# Altium project MEMESAT - PoBoI - Updated LTC.PrjPcb (part 2 of 2)

## Sheet PC104.SchDoc
size A; SheetNumber: 1; SheetTotal: 18
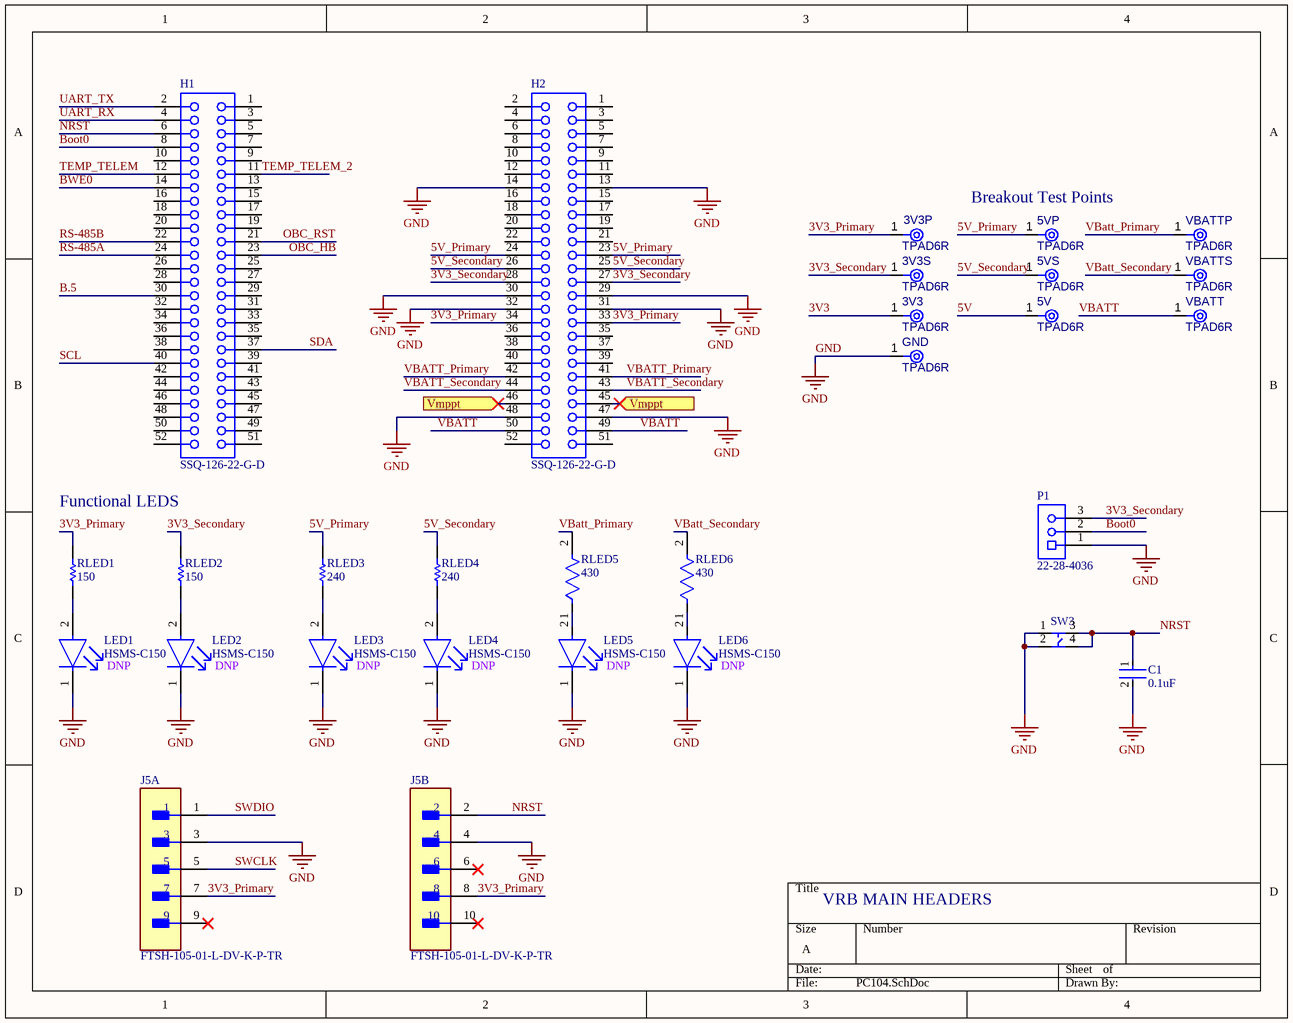
[diagram p7: PC104.SchDoc]

### Parts
3V3  TPAD6R  [TP06R]  (no BOM)
3V3P  TPAD6R  [TP06R]  (no BOM)
3V3S  TPAD6R  [TP06R]  (no BOM)
5V  TPAD6R  [TP06R]  (no BOM)
5VP  TPAD6R  [TP06R]  (no BOM)
5VS  TPAD6R  [TP06R]  (no BOM)
C1  0.1uF  [FP-C0603-CJ-MFG]
GND  TPAD6R  [TP06R]  (no BOM)
H1  SSQ-126-22-G-D  [SMTC-SSQ-126-22-X-D]
H2  SSQ-126-22-G-D  [SMTC-SSQ-126-22-X-D]
J5  FTSH-105-01-L-DV-K-P-TR  [FP-FTSH-105-01-L-DV-K-P-T-MFG]  (parts A,B of 2)
LED1  HSMS-C150  [FP-HSMS-C150-MFG]
LED2  HSMS-C150  [FP-HSMS-C150-MFG]
LED3  HSMS-C150  [FP-HSMS-C150-MFG]
LED4  HSMS-C150  [FP-HSMS-C150-MFG]
LED5  HSMS-C150  [FP-HSMS-C150-MFG]
LED6  HSMS-C150  [FP-HSMS-C150-MFG]
P1  22-28-4036  [22-28-4036-Footprint-1]
RLED1  150  [RESC1608X55X25ML10T15]
RLED2  150  [RESC1608X55X25ML10T15]
RLED3  240  [RESC1608X55X30NL20T20]
RLED4  240  [RESC1608X55X30NL20T20]
RLED5  430  [FP-CRCW0603-e3-IPC_B]
RLED6  430  [FP-CRCW0603-e3-IPC_B]
SW3  TS04-66-43-BK-100-SMT  [SOP127P600-8N]  (value not drawn)
VBATT  TPAD6R  [TP06R]  (no BOM)
VBATTP  TPAD6R  [TP06R]  (no BOM)
VBATTS  TPAD6R  [TP06R]  (no BOM)

### Ports
Vmppt (in)

### Nets
GND: C1.2 GND.1(TP) H2.13 H2.14 H2.29 H2.30 H2.31 H2.32 H2.47 H2.48 J5.3 J5.4 LED1.1(C) LED2.1(C) LED3.1(C) LED4.1(C) LED5.1(C) LED6.1(C) P1.1 SW3.1 SW3.2
3V3: 3V3.1(TP)
3V3_Primary: 3V3P.1(TP) H2.33 H2.34 J5.7 J5.8 RLED1.2
3V3_Secondary: 3V3S.1(TP) H2.27 H2.28 P1.3 RLED2.2
5V: 5V.1(TP)
5V_Primary: 5VP.1(TP) H2.23 H2.24 RLED3.2
5V_Secondary: 5VS.1(TP) H2.25 H2.26 RLED4.2
B.5: H1.30
Boot0: H1.8 P1.2
BWE0: H1.14
NRST: C1.1 H1.6 J5.2 SW3.3 SW3.4
OBC_HB: H1.23
OBC_RST: H1.21
RS-485A: H1.24
RS-485B: H1.22
SCL: H1.40
SDA: H1.37
SWCLK: J5.5
SWDIO: J5.1
TEMP_TELEM: H1.12
TEMP_TELEM_2: H1.11
UART_RX: H1.4
UART_TX: H1.2
VBATT: H2.49 H2.50 VBATT.1(TP)
VBatt_Primary: H2.41 H2.42 RLED5.2 VBATTP.1(TP)
VBatt_Secondary: H2.43 H2.44 RLED6.2 VBATTS.1(TP)
NetH2_45: H2.45 H2.46 ; port Vmppt
NetLED1_2: LED1.2(A) RLED1.1
NetLED2_2: LED2.2(A) RLED2.1
NetLED3_2: LED3.2(A) RLED3.1
NetLED4_2: LED4.2(A) RLED4.1
NetLED5_2: LED5.2(A) RLED5.1
NetLED6_2: LED6.2(A) RLED6.1

Not connected (* = marked no-connect by the designer): H1 1 3 5 7 9 10 13 15 16 17 18 19 20 25 26 27 28 29 31 32 33 34 35 36 38 39 41 42 43 44 45 46 47 48 49 50 51 52; H2 1 2 3 4 5 6 7 8 9 10 11 12 15 16 17 18 19 20 21 22 35 36 37 38 39 40 51 52; J5 6* 9* 10*

### Notes on the sheet
- (near 5VP) Breakout Test Points
- Functional LEDS
- (near LED1) DNP
- (near LED2) DNP
- (near LED3) DNP
- (near LED4) DNP
- (near LED5) DNP
- (near LED6) DNP
- VRB MAIN HEADERS

### Library data of the parts
3V3 3V3P 3V3S 5V 5VP 5VS GND VBATT VBATTP VBATTS = CMP-00028-00002-2: 0.6mm round; Pins: 1
C1 = CMP-2006-03300-2: CAP CER 0.1UF 50V X7R 0603 / C0603X104K5RACTU; Manufacturer: Kemet; Capacitance: 100nF; Material: Ceramic; Tolerance: 10%; Value: 100nF; Temperature Coefficient: 15%; Temperature Range High: +125°C; Temperature Range Low: -55°C; Manufacturer Part Number: C0603X104K5RACTU; Voltage: 50V; ComponentLink2Description: Datasheet; RoHS: TRUE; ComponentLink2URL: https://content.kemet.com/datasheets/KEM_C1013_X7R_FT-CAP_SMD.pdf; Device Class L3: Ceramic Capacitors; Device Class L2: Capacitors; Package: C0603-CJ; Height: 0.95mm; Device Class L1: Passive Components; Temperature Characteristic: X7R; Lead Free: Yes; Digikey Description: CAP CER 0.1UF 50V X7R 0603; Automotive: No; Mouser Description: Capacitor; Ceramic; Cap 0.1uF; Tol+10%; SMT; Flexible Termination; Vol-Rtg 50V; TR; Temperature: -55°C to +125°C; Octopart: https://octopart.com/c0603x104k5ractu-kemet-9145062; Category: Cap; Voltage Rating: 50V; Ipc Land Pattern Name: CAPC16080X80
H1 H2 = CMP-1023-00317-1: SQ Post Socket, Through-hole, Vertical, -55 to 125 degC, 2.54 mm Pitch, 52-Pin, Female, RoHS; Manufacturer: Samtec; Pitch: 2.54 mm; ComponentLink1Description: Manufacturer URL; ComponentLink3Description: Package Specification; PackageVersion: BD, 6/1987; ComponentLink2URL: http://www.samtec.com/documents/webfiles/pdf/SSQ_TH.PDF; Temperature Range: -55 to 125 degC; PackageDescription: Assembly, Socket Strip .025[0.64] SQ Tail; Mounting Technology: Through-hole; ComponentLink3URL: http://www.samtec.com/documents/webfiles/cpdf/SSQ-1XX-XX-XXX-X-XX-XXX-XX-X-MKT.pdf; PartNumber: SSQ-126-22-G-D; ComponentLink2Description: Datasheet; ComponentLink1URL: http://www.samtec.com; DatasheetVersion: F-214; RoHS: True; Orientation: Vertical; PackageReference: SSQ-126-22-X-D
J5 = CMP-002-00076-1: Board Connector, 10 Contact(s), 2 Row(s), Male, Straight, 0.05 inch Pitch, Surface Mount Terminal, Locking; RoHS Compliant: Yes; Connector Type: BOARD CONNECTOR; Mounting Technology: Board
LED1-LED6 = CMP-21615-000001-1: LED RED DIFFUSED CHIP SMD; Luminous Intensity: 10mcd; Power Dissipation: 65mW; Viewing Angle: 170°; Number of Elements: 1; Forward Current: 20mA; Lens Color: White; Lens Style: Rectangular; Wavelength: 626nm; Forward Voltage: 2.1V; Reverse Voltage: 5V; Number of Pins: 2; Color: Red; Lead Free: Lead Free; Width: 1.6mm; Length: 3.2mm; REACH SVHC: No SVHC; Height: 1.1mm; Depth: 1.6mm; Power Rating: 65mW; Package Quantity: 1; Illumination Color: Red; Radiation Hardening: No; Case Code (Imperial): 1206; Max Operating Temperature: 85°C; Test Current: 20mA; Case/Package: 1206; Lens Transparency: Diffused; Number of LEDs: 1; Packaging: Tape and Reel; Mount: Surface Mount; Min Operating Temperature: -40°C; Case Code (Metric): 3216; Dominant Wavelength: 626nm
P1 = CMP-002-00073-2: KK 254 Breakaway Header, Vertical, 3 Circuits, 0.76µm Gold (Au) Selective Plating, Mating Pin Length 6.09mm; Voltage Rating: 250V; Gender: Male; Min Operating Temperature: 0°C; Mounting Technology: Through Hole; Pins: 3; Max Operating Temperature: 75°C
RLED1 RLED2 = CMP-1659-00057-1: Chip Resistor, 150 Ohm, +/- 1%, 0.1 W, -55 to 155 degC, 0603 (1608 Metric), RoHS, Tape and Reel / RC0603FR-07150RL; Viewing Angle: 20 degrees; Luminous Intensity: 200 mcd; Case\Package: Radial; Lens Style: Clear; Nominal Vf: 2.2 V; Illumination Colour: Green; PackageReference: 0603; PackageDescription: 2-Pin Surface Mount Device, Body 1.6 x 0.8 mm; Package Quantity: 1000; Packaging: Bulk; DatasheetVersion: Rev. 4, 02/2016; ComponentLink2URL: http://www.yageo.com/documents/recent/PYu-RC_Group_51_RoHS_L_04.pdf; ComponentLink1Description: Manufacturer URL; Height: 8.6 mm; ComponentLink2Description: Datasheet; Mount: Through Hole; Colour: Green; RoHSCompliant: true; ComponentLink1URL: http://www.yageo.com/; Forward Voltage: 2.2 V
RLED3 RLED4 = CMP-2000-00001-1: 240 Ohm 0603 / ERA3AEB244V; Manufacturer: Panasonic; Part Number: ERA3AEB244V
RLED5 RLED6 = CMP-1012-00468-3: RES Thick Film, 430Ω, 1%, 0.1W, 100ppm/°C, 0603 / CRCW0603430RFKEA; Power Rating: 100mW; Voltage Rating: 75V; Resistance: 430R; Radiation Hardening: No; Width: 0.033inch; Max Operating Temperature: 155°C; Height: 0.45mm; Temperature Coefficient: 100ppm/°C; Number of Terminations: 2; Package Quantity: 10; Composition: Thick Film; Mount: Surface Mount; Contact Plating: Tin; Tolerance: 1%; Voltage Rating (DC): 75V; Case/Package: 0603; Features: Automotive AEC-Q200; Case Code (Imperial): 0603; Depth: 0.85mm; Termination: SMD/SMT; Packaging: Tape and Reel; Min Operating Temperature: -55°C; Weight: 7.1E-05oz; Case Code (Metric): 1608; Number of Pins: 2; Military Standard: Not; Lead Free: Lead Free; Length: 1.55mm; Working Voltage: 75V; Max Power Dissipation: 100mW
SW3 = CMP-011-00014-3: Momentary Switch; Rated Voltage Max: 1 V; Rated Voltage Min: 12 V; Rated Current Max: 0.01 mA; Rated Current Min: 50 mA; DataSheet: https://www.cuidevices.com/product/resource/ts04.pdf

## Sheet STM32.SchDoc
size A; SheetNumber: 2; SheetTotal: 18
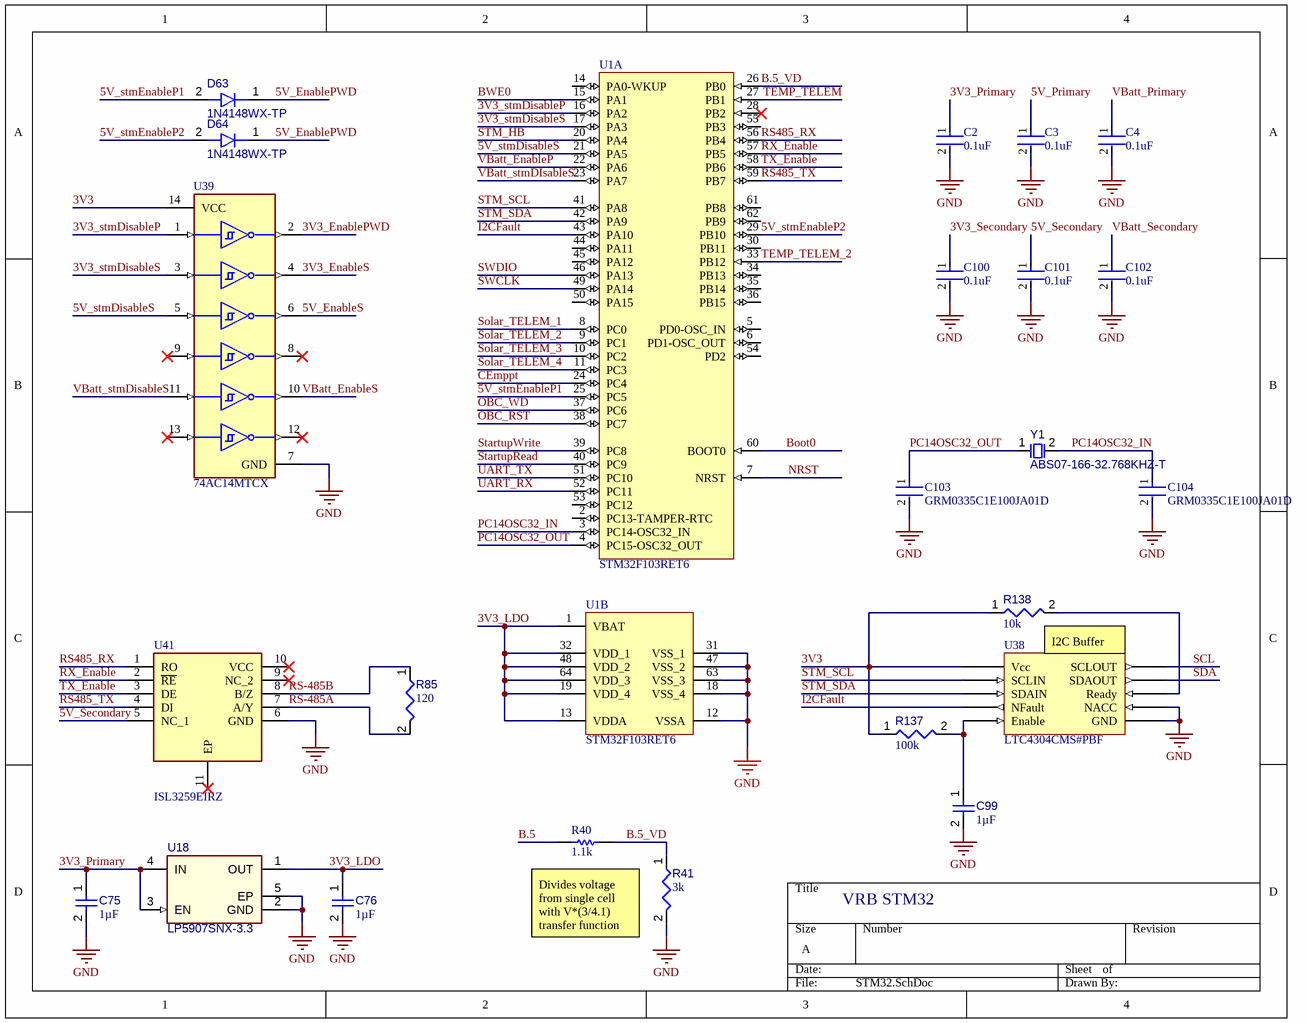
[diagram p8: STM32.SchDoc]

### Parts
C2  0.1uF  [FP-C0603-CJ-MFG]
C3  0.1uF  [FP-C0603-CJ-MFG]
C4  0.1uF  [FP-C0603-CJ-MFG]
C75  value 1µF  [FP-CC0201-BA-IPC_A]  (hidden comment: CC0201KRX5R5BB105)
C76  value 1µF  [FP-CC0201-BA-IPC_A]  (hidden comment: CC0201KRX5R5BB105)
C99  value 1µF  [CAPC1608X94X35NL15T15]  (hidden comment: Capacitor 1 uF +/- 10% 16 V 0603)
C100  0.1uF  [FP-C0603-CJ-MFG]
C101  0.1uF  [FP-C0603-CJ-MFG]
C102  0.1uF  [FP-C0603-CJ-MFG]
C103  GRM0335C1E100JA01D  [FP-GRM033-0_03-IPC_A]
C104  GRM0335C1E100JA01D  [FP-GRM033-0_03-IPC_A]
D63  1N4148WX-TP  [1N4148WX-TP-Footprint-1]
D64  1N4148WX-TP  [1N4148WX-TP-Footprint-1]
R40  1.1k  [RESC1005X40X25NL05T10]
R41  value 3k  [RESC0402(1005)_L]  (hidden comment: 3KR2F)
R85  value 120  [RESC0603(1608)_L]  (hidden comment: 120R3J)
R137  value 100k  [RESC3216X60X45ML15T20]  (hidden comment: Resistor 100k +/-1% 1206 250 mW)
R138  value 10k  [RESC1608X55X25ML10T15]  (hidden comment: Resistor 10k +/-1% 0603 100 mW)
U1  STM32F103RET6  [STM-LQFP64_N]  (parts A,B of 2)
U18  LP5907SNX-3.3  [TI-DQN4-480X480TP_V]
U38  LTC4304CMS#PBF  [LTC4304CMS#PBF-Footprint-1]
U39  74AC14MTCX  [FP-948G-MFG]
U41  ISL3259EIRZ  [ISL3259EIRZ-Footprint-1]
Y1  ABS07-166-32.768KHZ-T  [EPSON-FC-135_V]

### Nets
GND: C2.2 C3.2 C4.2 C75.2 C76.2 C99.2 C100.2 C101.2 C102.2 C103.2 C104.2 R41.2 U1.12(VSSA) U1.18(VSS_4) U1.31(VSS_1) U1.47(VSS_2) U1.63(VSS_3) U18.2(GND) U18.5(EP) U38.4(NACC) U38.5(GND) U39.7(GND) U41.6(GND)
3V3: R137.1 R138.1 U38.10(Vcc) U39.14(VCC)
3V3_EnablePWD: U39.2(~{O}0)
3V3_EnableS: U39.4(~{O}1)
3V3_LDO: C76.1 U1.1(VBAT) U1.13(VDDA) U1.19(VDD_4) U1.32(VDD_1) U1.48(VDD_2) U1.64(VDD_3) U18.1(OUT)
3V3_Primary: C2.1 C75.1 U18.3(EN) U18.4(IN)
3V3_Secondary: C100.1
3V3_stmDisableP: U1.16(PA2) U39.1(I0)
3V3_stmDisableS: U1.17(PA3) U39.3(I1)
5V_EnablePWD: D63.1(K) D64.1(K)
5V_EnableS: U39.6(~{O}2)
5V_Primary: C3.1
5V_Secondary: C101.1 U41.5(NC_1)
5V_stmDisableS: U1.21(PA5) U39.5(I2)
5V_stmEnableP1: D63.2(A) U1.25(PC5)
5V_stmEnableP2: D64.2(A) U1.29(PB10)
B.5: R40.1
B.5_VD: R40.2 R41.1 U1.26(PB0)
Boot0: U1.60(BOOT0)
BWE0: U1.15(PA1)
~{CEmppt}: U1.24(PC4)
I2CFault: U1.43(PA10) U38.7(NFault)
NRST: U1.7(NRST)
OBC_RST: U1.38(PC7)
OBC_WD: U1.37(PC6)
PC14OSC32_IN: C104.1 U1.3(PC14-OSC32_IN) Y1.2
PC14OSC32_OUT: C103.1 U1.4(PC15-OSC32_OUT) Y1.1
~{RX_Enable}: U1.57(PB5) U41.2(~{RE})
RS485_RX: U1.56(PB4) U41.1(RO)
RS485_TX: U1.59(PB7) U41.4(DI)
RS-485A: R85.2 U41.7(A/Y)
RS-485B: R85.1 U41.8(B/Z)
SCL: U38.2(SCLOUT)
SDA: U38.9(SDAOUT)
Solar_TELEM_1: U1.8(PC0)
Solar_TELEM_2: U1.9(PC1)
Solar_TELEM_3: U1.10(PC2)
Solar_TELEM_4: U1.11(PC3)
StartupRead: U1.40(PC9)
StartupWrite: U1.39(PC8)
STM_HB: U1.20(PA4)
STM_SCL: U1.41(PA8) U38.3(SCLIN)
STM_SDA: U1.42(PA9) U38.8(SDAIN)
SWCLK: U1.49(PA14)
SWDIO: U1.46(PA13)
TEMP_TELEM: U1.27(PB1)
TEMP_TELEM_2: U1.33(PB12)
TX_Enable: U1.58(PB6) U41.3(DE)
UART_RX: U1.52(PC11)
UART_TX: U1.51(PC10)
VBatt_EnableP: U1.22(PA6)
VBatt_EnableS: U39.10(~{O}4)
VBatt_Primary: C4.1
VBatt_Secondary: C102.1
VBatt_stmDIsableS: U1.23(PA7) U39.11(I4)
NetC99_1: C99.1 R137.2 U38.1(Enable)
NetR138_2: R138.2 U38.6(Ready)

Not connected (* = marked no-connect by the designer): U1 2(PC13-TAMPER-RTC) 5(PD0-OSC_IN) 6(PD1-OSC_OUT) 14(PA0-WKUP) 28(PB2)* 30(PB11) 34(PB13) 35(PB14) 36(PB15) 44(PA11) 45(PA12) 50(PA15) 53(PC12) 54(PD2) 55(PB3) 61(PB8) 62(PB9); U39 8(~{O}3)* 9(I3)* 12(~{O}5)* 13(I5)*; U41 9(NC_2)* 10(VCC)* 11(EP)*

### Notes on the sheet
- I2C Buffer
- VRB STM32
- Divides voltage from single cell with V*(3/4.1) transfer function

### Library data of the parts
C2-C4 C100-C102 = CMP-2006-03300-2: as C1 on sheet PC104; Temperature Range High: +125°C; Temperature Range Low: -55°C; Manufacturer Part Number: C0603X104K5RACTU; Voltage: 50V; ComponentLink2Description: Datasheet; RoHS: TRUE; ComponentLink2URL: https://content.kemet.com/datasheets/KEM_C1013_X7R_FT-CAP_SMD.pdf; Device Class L3: Ceramic Capacitors; Device Class L2: Capacitors; Package: C0603-CJ; Height: 0.95mm; Device Class L1: Passive Components; Temperature Characteristic: X7R; Lead Free: Yes; Digikey Description: CAP CER 0.1UF 50V X7R 0603; Automotive: No; Mouser Description: Capacitor; Ceramic; Cap 0.1uF; Tol+10%; SMT; Flexible Termination; Vol-Rtg 50V; TR; Temperature: -55°C to +125°C; Octopart: https://octopart.com/c0603x104k5ractu-kemet-9145062; Category: Cap; Voltage Rating: 50V; Ipc Land Pattern Name: CAPC16080X80
C75 C76 = CMP-001-00088-1: Ceramic Capacitor, Multilayer, Ceramic, 6.3V, 10% +Tol, 10% -Tol, X5R, 15% TC, 1uF, Surface Mount, 0201; Capacitor Type: Ceramic; Max Operating Temperature: 85°C; RoHS Compliant: Yes; Mounting Technology: Surface Mount; Min Operating Temperature: -55°C; Case/Package: 0201; Pins: 2
C99 = CMP-001-00003-6: Chip Capacitor, 1 uF, +/- 10%, 16 V, 0603 (1608 Metric); Voltage Rating: 16V; Capacitor Type: Ceramic; Max Operating Temperature: 125°C; Pins: 2; Tolerance: 10%; Min Operating Temperature: -55°C; RoHS Compliant: True; Mounting Technology: SM; Case/Package: 0603
C103 C104 = CMP-2010-01302-2: Chip Multilayer Ceramic Capacitors for General Purpose, 0201, 10pF, C0G, 30ppm/°C, 5%, 25V; Length: 0.024inch; Voltage Rating: 25V; Packaging: Tape and Reel; Max Operating Temperature: 125°C; Mount: Surface Mount; Capacitance: 10pF; Tolerance: 5%; Series: GRM; Case Code (Metric): 0603; Package Quantity: 1; Voltage Rating (DC): 25V; Depth: 0.3mm; Min Operating Temperature: -55°C; Width: 0.012inch; Thickness: 0.013inch; Termination: SMD/SMT; Lead Free: Lead Free; Case/Package: 0201; Case Code (Imperial): 0201; Dielectric: C0G; REACH SVHC: No SVHC
D63 = CMP-004-00035-2: Rectifier Diode, 1 Phase, 1 Element, 0.15A, 100V V(RRM), Silicon
D64 = CMP-004-00035-3: Rectifier Diode, 1 Phase, 1 Element, 0.15A, 100V V(RRM), Silicon
R40 = CMP-2002-07452-1: Part Number: RC0402FR-071K1L; Manufacturer: Yageo / Phycomp
R41 = CMP-009-00099-2: 3K 0.063W 1% 0402 (1005 Metric)  SMD; Power: 63mW; Case/Package: 0402; Tolerance: 1%; Mounting Technology: SMT; Pins: 2
R85 = CMP-009-00069-2: 120R 0.1W 5% 0603 (1608 Metric)  SMD; Power: 100mW; Mounting Technology: SMT; Tolerance: 5%; Case/Package: 0603; Pins: 2
R137 = CMP-009-00025-5: Chip Resistor, 100 KOhm, +/- 1%, 0.25 W, -55 to 155 degC, 1206 (3216 Metric); Voltage Rating: 200V; Power: 250mW; RoHS Compliant: True; Max Operating Temperature: 155°C; Pins: 2; Tolerance: 1%; Mounting Technology: SM; Case/Package: 1206; Min Operating Temperature: -55°C
R138 = CMP-009-00017-5: Chip Resistor, 10 KOhm, +/- 1%, 01 W, -55 to 155 degC, 0603 (1608 Metric); Voltage Rating: 50V; Power: 100mW; RoHS Compliant: True; Min Operating Temperature: -55°C; Pins: 2; Case/Package: 0603; Mounting Technology: SM; Max Operating Temperature: 155°C; Tolerance: 1%
U1 = CMP-0237-00201-3: ARM Cortex-M3 32-bit MCU, 512 KB Flash, 64 KB Internal RAM, 51 I/Os, 64-pin LQFP, -40 to 85 degC, Tray; FLASH Size (Prog) (kB): 512; Internal RAM Size (kB): 64; A/D Converter: 3x12-bit (16 Channel); I/Os (High Current): 51; Supply Voltage(Vcc) min (V): 2; D/A Converter: 2x12-bit (2 Channel); Operating Frequency(F) (Processor speed) (MHz): 72; PackageDescription: 64-Pin Low Profile Quad Flat Package, 10 x 10 mm Body, 0.5 mm Pitch; ComponentLink3URL: http://www.st.com/st-web-ui/static/active/en/resource/technical/document/datasheet/DM00037051.pdf; DatasheetVersion: Rev. 8; Packing: Tray; PackageReference: LQFP64; ComponentLink3Description: Package Specification; Core: ARM Cortex-M3; Mounting Technology: Surface Mount; PartNumber: STM32F103RET6; PackageVersion: Rev. 4, 06/2013; ComponentLink1URL: http://www.st.com/web/en/home.html; ComponentLink1Description: Manufacturer URL; ComponentLink2Description: Datasheet; ComponentLink2URL: http://www.st.com/st-web-ui/static/active/en/resource/technical/document/datasheet/CD00191185.pdf
U18 = CMP-019-00040-3: Ultra-Low-Noise, Low-IQ LDO, 3.3 V, 0.25 A, -40 to 125 degC, 4-Pin X2SON, RoHS, Tape and Reel; Output Voltage: 3.3V; Pins: 5; Max Operating Temperature: 125°C; Min Operating Temperature: -40°C
U38 = CMP-015-00009-7: Interface Circuit, PDSO10; Max Supply Voltage: 5.5V; Min Supply Voltage: 2.7V; Nominal Supply Voltage: 3.3V; RoHS Compliant: Yes; Max Operating Temperature: 70°C; Min Operating Temperature: 0°C; Pins: 10; Case/Package: TSSOP
U39 = CMP-016-00013-1: Inverter, AC Series, 6-Func, 1-Input, CMOS, PDSO14; Min Supply Voltage: 2V; Nominal Supply Voltage: 3.3V; Max Supply Voltage: 6V; RoHS Compliant: Yes; Case/Package: TSSOP; Min Operating Temperature: -40°C; Max Operating Temperature: 85°C; Pins: 14; Logic Type: INVERTER
U41 = CMP-015-00010-2: Line Transceiver, 1 Func, 1 Driver, 1 Rcvr, BICMOS, PDSO10; Min Supply Voltage: 4.75V; Nominal Supply Voltage: 5V; Max Supply Voltage: 5.25V; Case/Package: HVSON; RoHS Compliant: Yes; Pins: 10; Max Operating Temperature: 85°C; Min Operating Temperature: -40°C
Y1 = CMP-003-00029-1: Crystal 32.768kHz 10ppm 7pF -40C +85C; Pins: 2; Frequency: 32.768kHz

## Sheet VBATTPrimary.SchDoc
size A; SheetNumber: 15; SheetTotal: 18
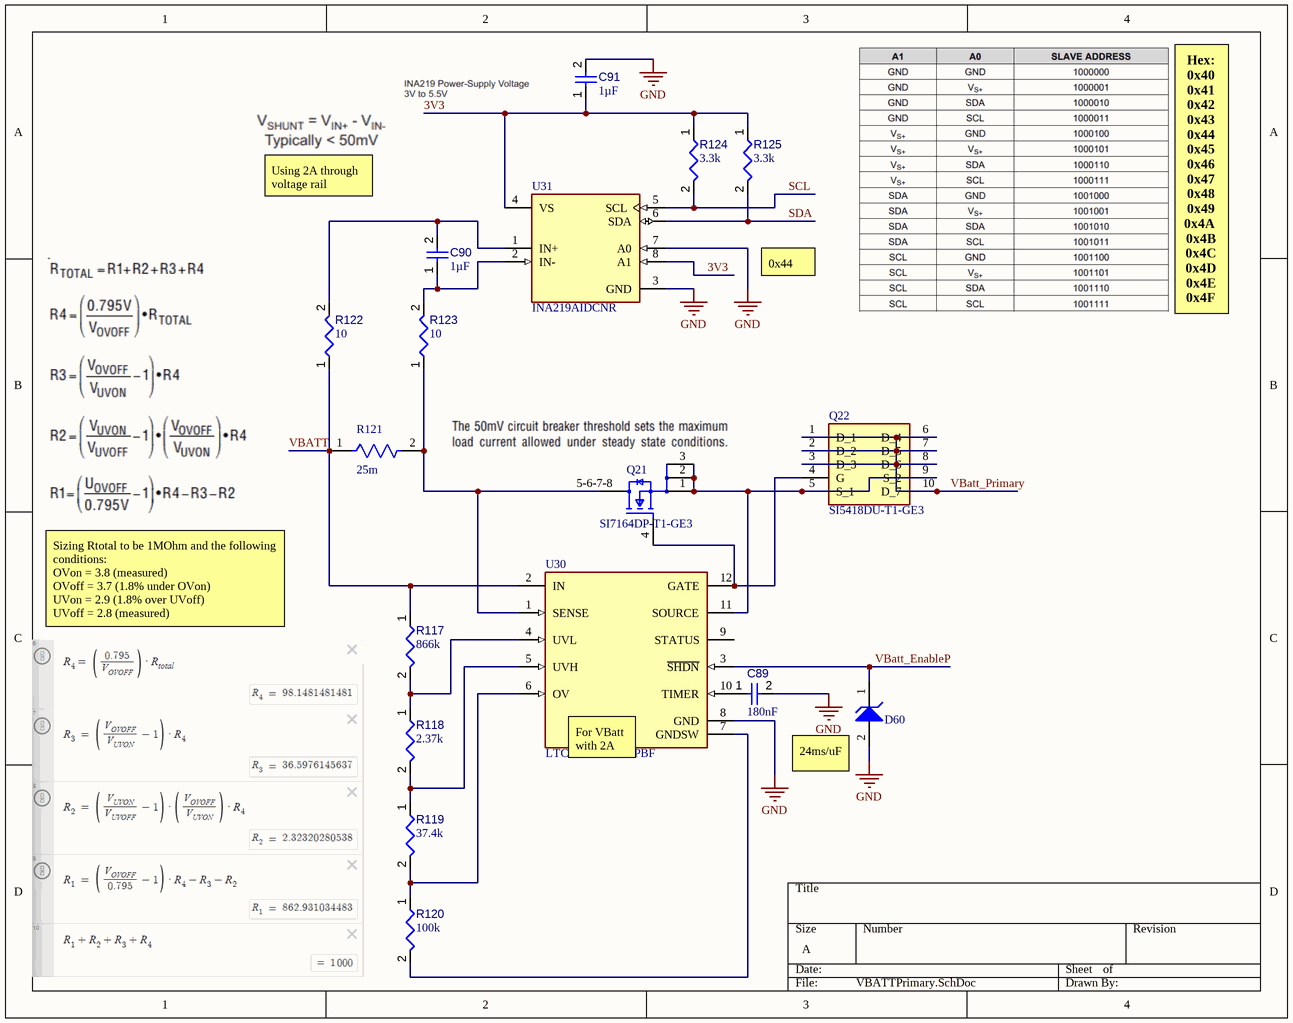
[diagram p9: VBATTPrimary.SchDoc]

### Parts
C89  value 180nF  [FP-C0805C-DN-IPC_A]  (hidden comment: C0805C184K5RACTU)
C90  value 1µF  [CAPC1608X90X40LL10T20]  (hidden comment: Capacitor 1 uF +/- 10% 25 V 0603)
C91  value 1µF  [CAPC1608X90X35ML15T15]  (hidden comment: Capacitor 1uF +/- 10% 16V 0603)
D60  MM3Z3V6T1G  [ONSC-SOD-323-2-477-02_V]  (value not drawn)
Q21  SI7164DP-T1-GE3  [Vishay_S17-0173-SINGLE_MFG]
Q22  SI5418DU-T1-GE3  [SI5418DU-T1-GE3-Footprint-1]
R117  value 866k  [RESC0603X26X15NL03T05]  (hidden comment: MC0201L6F8663SE)
R118  value 2.37k  [RESC0402(1005)_L]  (hidden comment: 2D37KR2F)
R119  value 37.4k  [FP-CR0603-IPC_A]  (hidden comment: CR0603-FX-3742ELF)
R120  value 100k  [RESC1005X40X25ML05T05]  (hidden comment: Resistor 100k +/-1% 0402 100 mW)
R121  Resistance: 25m  [FP-CSR1206-IPC_C]  (hidden comment: CSR1206FK25L0)
R122  value 10  [RESC0402(1005)_L]  (hidden comment: Resistor 10R  +/-1 % 0402 63 mW)
R123  value 10  [RESC0402(1005)_L]  (hidden comment: Resistor 10R  +/-1 % 0402 63 mW)
R124  value 3.3k  [FP-CRCW1210-e3-IPC_C]  (hidden comment: CRCW12103K30JNEA)
R125  value 3.3k  [FP-CRCW1210-e3-IPC_C]  (hidden comment: CRCW12103K30JNEA)
U30  LTC4231HMS-1#PBF  [FP-MS-12-05-08-1668-MFG]
U31  INA219AIDCNR  [FP-DCN0008A-IPC_A]

### Nets
GND: C89.2 C91.2 D60.2(A) U30.8(GND) U31.3(GND) U31.7(A0)
3V3: C91.1 R124.1 R125.1 U31.4(VS) U31.8(A1)
SCL: R124.2 U31.5(SCL)
SDA: R125.2 U31.6(SDA)
VBATT: R117.1 R121.1 R122.1 U30.2(IN)
VBatt_EnableP: D60.1(K) U30.3(~{SHDN})
VBatt_Primary: Q22.1(D_1) Q22.2(D_2) Q22.3(D_3) Q22.6(D_4) Q22.7(D_5) Q22.8(D_6) Q22.10(D_7)
NetC89_1: C89.1 U30.10(TIMER)
NetC90_1: C90.1 R123.2 U31.2(IN-)
NetC90_2: C90.2 R122.2 U31.1(IN+)
NetQ21_1: Q21.1(S) Q21.2(S) Q21.3(S) Q22.5(S_1) Q22.9(S_2) U30.11(SOURCE)
NetQ21_4: Q21.4(G) Q22.4(G) U30.12(GATE)
NetQ21_5-6-7-8: Q21.5-6-7-8(D) R121.2 R123.1 U30.1(SENSE)
NetR117_2: R117.2 R118.1 U30.4(UVL)
NetR118_2: R118.2 R119.1 U30.5(UVH)
NetR119_2: R119.2 R120.1 U30.6(OV)
NetR120_2: R120.2 U30.7(GNDSW)

Not connected (* = marked no-connect by the designer): U30 9(STATUS)

### Notes on the sheet
- Using 2A through voltage rail
- 0x44
- Hex:
  0x40
  0x41
  0x42
  0x43
  0x44
  0x45
  0x46
  0x47
  0x48
  0x49
  0x4A
  0x4B
  0x4C
  0x4D
  0x4E
  0x4F
- Sizing Rtotal to be 1MOhm and the following conditions:
  OVon = 3.8 (measured)
  OVoff = 3.7 (1.8% under OVon)
  UVon = 2.9 (1.8% over UVoff)
  UVoff = 2.8 (measured)
- (near U30) For VBatt
  with 2A
- (near D60) 24ms/uF

### Library data of the parts
C89 = CMP-001-00086-1: Ceramic Capacitor, Multilayer, Ceramic, 50V, 10% +Tol, 10% -Tol, X7R, 15% TC, 0.18uF, Surface Mount, 0805; Capacitor Type: Ceramic; Mounting Technology: Surface Mount; Pins: 2; Min Operating Temperature: -55°C; Case/Package: 0805; Max Operating Temperature: 125°C; RoHS Compliant: Yes
C90 = CMP-001-00005-6: Chip Capacitor, 1 uF, +/- 10%, 25 V, 0603 (1608 Metric); Capacitor Type: Ceramic; Voltage Rating: 25V; Pins: 2; Mounting Technology: SM; RoHS Compliant: True; Max Operating Temperature: 125°C; Case/Package: 0603; Min Operating Temperature: -55°C; Tolerance: 10%
C91 = CMP-001-00004-6: Chip Capacitor, 1 uF, +/- 10%, 16 V, 0603 (1608 Metric); Capacitor Type: Ceramic; Mounting Technology: SM; RoHS Compliant: True; Min Operating Temperature: -55°C; Case/Package: 0603; Pins: 2; Voltage Rating: 16V; Max Operating Temperature: 125°C; Tolerance: 10%
D60 = CMP-1060-00650-1: Zener Voltage Regulator, 300 mW, 2-Pin SOD-323, Pb-Free, Tape and Reel; Manufacturer: On Semiconductor; VZ Typ (V): 3.6; P Max (W): 0.3; RoHS: Pb-Free; ComponentLink1URL: http://www.onsemi.com/; PackageVersion: Rev. H, 03/2007; PartNumber: MM3Z3V6T1G; ComponentLink2Description: Datasheet; ComponentLink2URL: http://www.onsemi.cn/pub_link/Collateral/MM3Z2V4T1-D.PDF; DatasheetVersion: Rev. 9; PackageReference: SOD-323-2-477-02; ComponentLink3URL: http://www.onsemi.com/pub_link/Collateral/477-02.PDF.1; Packing: Tape and Reel; Mounting Technology: Surface Mount; ComponentLink3Description: Package Specification; PackageDescription: 2-Pin SOD, Body 1.7 x 1.25 mm; ComponentLink1Description: Manufacturer URL
Q21 = CMP-013-00040-1: Power Field-Effect Transistor, 23.5A I(D), 60V, 0.00625ohm, 1-Element, N-Channel, Silicon, Metal-oxide Semiconductor FET; Pins: 5; RoHS Compliant: Yes; Max Operating Temperature: 150°C
Q22 = CMP-013-00041-1: Power Field-Effect Transistor, 11.6A I(D), 30V, 0.0145ohm, 1-Element, N-Channel, Silicon, Metal-oxide Semiconductor FET; Max Operating Temperature: 150°C; RoHS Compliant: Yes; Pins: 3
R117 = CMP-009-00205-1: Fixed Resistor, Metal Glaze/thick Film, 0.05W, 866000ohm, 25V, 1% +/-Tol, -200,200ppm/Cel, 0201; Power: 50mW; Max Operating Temperature: 125°C; Tolerance: 1%; Case/Package: 0201; Pins: 2; RoHS Compliant: Yes; Min Operating Temperature: -55°C
R118 = CMP-009-00089-2: 2K37 0.063W 1% 0402 (1005 Metric)  SMD; Power: 63mW; Pins: 2; Tolerance: 1%; Case/Package: 0402; Mounting Technology: SMT
R119 = CMP-009-00206-1: Fixed Resistor, Metal Glaze/thick Film, 0.1W, 37400ohm, 75V, 1% +/-Tol, 100ppm/Cel, Surface Mount, 0603; Power: 100mW; Min Operating Temperature: -55°C; Mounting Technology: Surface Mount; Case/Package: 0603; Max Operating Temperature: 155°C; RoHS Compliant: Yes; Pins: 2; Tolerance: 1%
R120 = CMP-009-00022-5: Chip Resistor, 100 KOhm, +/- 1%, 0.1 W, -55 to 155 degC, 0402 (1005 Metric); Power: 100mW; Voltage Rating: 50V; Mounting Technology: SM; Pins: 2; Min Operating Temperature: -55°C; Tolerance: 1%; RoHS Compliant: True; Case/Package: 0402; Max Operating Temperature: 155°C
R121 = CMP-26527-000133-1: General Purpose Thick Film Chip Resistor, 1206, 25mΩ, 1%, 0.5W; Max Power Dissipation: 500mW; Temperature Coefficient: 100ppm/°C; Lead Free: Lead Free; Military Standard: Not; Case Code (Imperial): 1206; Max Operating Temperature: 155°C; Case Code (Metric): 3216; Height: 0.026inch; Packaging: Tape and Reel; Case/Package: 1206; Series: CSR; Number of Terminations: 2; RoHS Compliant: Yes; Mount: Surface Mount; Depth: 1.55mm; Contact Plating: Tin; Length: 0.12inch; Radiation Hardening: No; Width: 0.061inch; Size Code: 1206; Power Rating: 500mW; Min Operating Temperature: -55°C; Tolerance: 1%; Resistor Type: Thick Film; Construction: Rectangular
R122 R123 = CMP-009-00152-3: Chip Resistor, 10 Ohms, +/-1 %, 63 mW, -55 to 155 degC, 0402; Tolerance: 1%; Power: 63mW; Pins: 2; Max Operating Temperature: 155°C; Min Operating Temperature: -55°C; Case/Package: 0402
R124 R125 = CMP-009-00192-1: Fixed Resistor, Metal Glaze/thick Film, 0.5W, 3300ohm, 200V, 5% +/-Tol, 200ppm/Cel, Surface Mount, 1210; Power: 500mW; RoHS Compliant: Yes; Max Operating Temperature: 155°C; Case/Package: 1210; Min Operating Temperature: -55°C; Mounting Technology: Surface Mount; Tolerance: 5%; Pins: 2
U30 = CMP-09134-000012-1: IC HOT SWAP CTRLR GP 12MSOP; Operating Supply Current: 4uA; Number of Channels: 1; Min Supply Voltage: 2.7V; Max Supply Voltage: 36V; Number of Pins: 12; Features: Latched Fault; Max Operating Temperature: 125°C; Mount: Surface Mount; Packaging: Rail/Tube; Min Operating Temperature: -40°C; REACH SVHC: No SVHC; Case/Package: MSOP; RoHS Compliant: Yes
U31 = CMP-010-00025-1: Power Supply Support Circuit, Fixed, 2 Channel, 2V, PDSO8; Nominal Supply Voltage: 3.3V; Max Supply Voltage: 5.5V; Min Supply Voltage: 3V; Case/Package: LSSOP; Max Operating Temperature: 125°C; Min Operating Temperature: -40°C; Pins: 8; RoHS Compliant: Yes

## Sheet VBATTSecondary.SchDoc
size A; SheetNumber: 16; SheetTotal: 18
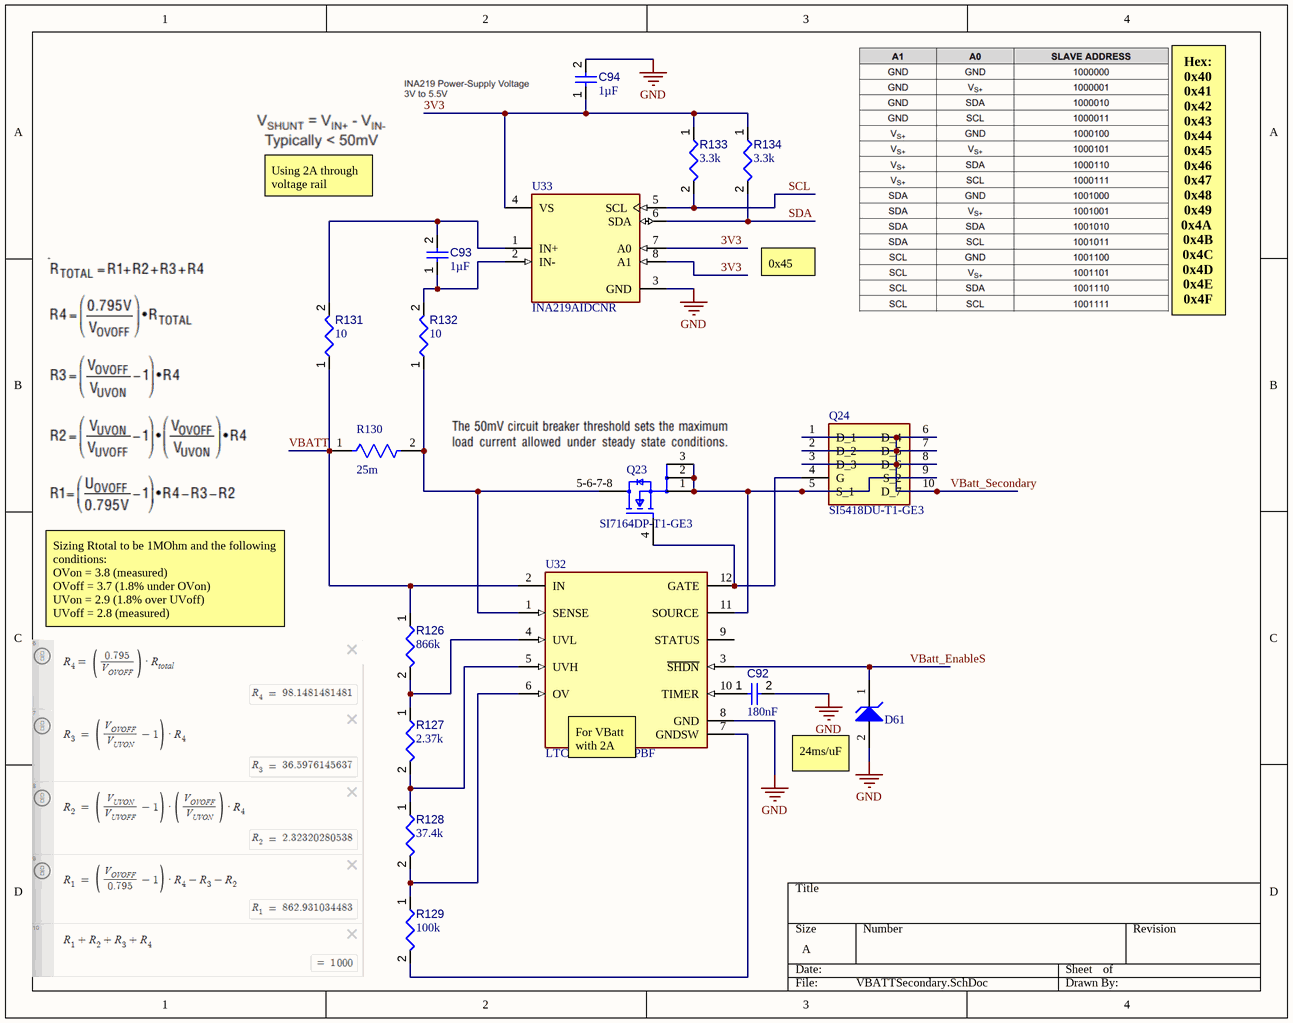
[diagram p10: VBATTSecondary.SchDoc]

### Parts
C92  value 180nF  [FP-C0805C-DN-IPC_A]  (hidden comment: C0805C184K5RACTU)
C93  value 1µF  [CAPC1608X90X40LL10T20]  (hidden comment: Capacitor 1 uF +/- 10% 25 V 0603)
C94  value 1µF  [CAPC1608X90X35ML15T15]  (hidden comment: Capacitor 1uF +/- 10% 16V 0603)
D61  MM3Z3V6T1G  [ONSC-SOD-323-2-477-02_V]  (value not drawn)
Q23  SI7164DP-T1-GE3  [Vishay_S17-0173-SINGLE_MFG]
Q24  SI5418DU-T1-GE3  [SI5418DU-T1-GE3-Footprint-1]
R126  value 866k  [RESC0603X26X15NL03T05]  (hidden comment: MC0201L6F8663SE)
R127  value 2.37k  [RESC0402(1005)_L]  (hidden comment: 2D37KR2F)
R128  value 37.4k  [FP-CR0603-IPC_A]  (hidden comment: CR0603-FX-3742ELF)
R129  value 100k  [RESC1005X40X25ML05T05]  (hidden comment: Resistor 100k +/-1% 0402 100 mW)
R130  Resistance: 25m  [FP-CSR1206-IPC_C]  (hidden comment: CSR1206FK25L0)
R131  value 10  [RESC0402(1005)_L]  (hidden comment: Resistor 10R  +/-1 % 0402 63 mW)
R132  value 10  [RESC0402(1005)_L]  (hidden comment: Resistor 10R  +/-1 % 0402 63 mW)
R133  value 3.3k  [FP-CRCW1210-e3-IPC_C]  (hidden comment: CRCW12103K30JNEA)
R134  value 3.3k  [FP-CRCW1210-e3-IPC_C]  (hidden comment: CRCW12103K30JNEA)
U32  LTC4231HMS-1#PBF  [FP-MS-12-05-08-1668-MFG]
U33  INA219AIDCNR  [FP-DCN0008A-IPC_A]

### Nets
GND: C92.2 C94.2 D61.2(A) U32.8(GND) U33.3(GND)
3V3: C94.1 R133.1 R134.1 U33.4(VS) U33.7(A0) U33.8(A1)
SCL: R133.2 U33.5(SCL)
SDA: R134.2 U33.6(SDA)
VBATT: R126.1 R130.1 R131.1 U32.2(IN)
VBatt_EnableS: D61.1(K) U32.3(~{SHDN})
VBatt_Secondary: Q24.1(D_1) Q24.2(D_2) Q24.3(D_3) Q24.6(D_4) Q24.7(D_5) Q24.8(D_6) Q24.10(D_7)
NetC92_1: C92.1 U32.10(TIMER)
NetC93_1: C93.1 R132.2 U33.2(IN-)
NetC93_2: C93.2 R131.2 U33.1(IN+)
NetQ23_1: Q23.1(S) Q23.2(S) Q23.3(S) Q24.5(S_1) Q24.9(S_2) U32.11(SOURCE)
NetQ23_4: Q23.4(G) Q24.4(G) U32.12(GATE)
NetQ23_5-6-7-8: Q23.5-6-7-8(D) R130.2 R132.1 U32.1(SENSE)
NetR126_2: R126.2 R127.1 U32.4(UVL)
NetR127_2: R127.2 R128.1 U32.5(UVH)
NetR128_2: R128.2 R129.1 U32.6(OV)
NetR129_2: R129.2 U32.7(GNDSW)

Not connected (* = marked no-connect by the designer): U32 9(STATUS)

### Notes on the sheet
- Using 2A through voltage rail
- 0x45
- Hex:
  0x40
  0x41
  0x42
  0x43
  0x44
  0x45
  0x46
  0x47
  0x48
  0x49
  0x4A
  0x4B
  0x4C
  0x4D
  0x4E
  0x4F
- Sizing Rtotal to be 1MOhm and the following conditions:
  OVon = 3.8 (measured)
  OVoff = 3.7 (1.8% under OVon)
  UVon = 2.9 (1.8% over UVoff)
  UVoff = 2.8 (measured)
- (near U32) For VBatt
  with 2A
- (near D61) 24ms/uF

### Library data of the parts
C92 = CMP-001-00086-1: as C89 on sheet VBATTPrimary; Capacitor Type: Ceramic; Mounting Technology: Surface Mount; Pins: 2; Min Operating Temperature: -55°C; Case/Package: 0805; Max Operating Temperature: 125°C; RoHS Compliant: Yes
C93 = CMP-001-00005-6: as C90 on sheet VBATTPrimary; Pins: 2; Mounting Technology: SM; RoHS Compliant: True; Max Operating Temperature: 125°C; Case/Package: 0603; Min Operating Temperature: -55°C; Tolerance: 10%
C94 = CMP-001-00004-6: as C91 on sheet VBATTPrimary; Mounting Technology: SM; RoHS Compliant: True; Min Operating Temperature: -55°C; Case/Package: 0603; Pins: 2; Voltage Rating: 16V; Max Operating Temperature: 125°C; Tolerance: 10%
D61 = CMP-1060-00650-1: as D60 on sheet VBATTPrimary; RoHS: Pb-Free; ComponentLink1URL: http://www.onsemi.com/; PackageVersion: Rev. H, 03/2007; PartNumber: MM3Z3V6T1G; ComponentLink2Description: Datasheet; ComponentLink2URL: http://www.onsemi.cn/pub_link/Collateral/MM3Z2V4T1-D.PDF; DatasheetVersion: Rev. 9; PackageReference: SOD-323-2-477-02; ComponentLink3URL: http://www.onsemi.com/pub_link/Collateral/477-02.PDF.1; Packing: Tape and Reel; Mounting Technology: Surface Mount; ComponentLink3Description: Package Specification; PackageDescription: 2-Pin SOD, Body 1.7 x 1.25 mm; ComponentLink1Description: Manufacturer URL
Q23 = CMP-013-00040-1: as Q21 on sheet VBATTPrimary; Pins: 5; RoHS Compliant: Yes; Max Operating Temperature: 150°C
Q24 = CMP-013-00041-1: as Q22 on sheet VBATTPrimary; Max Operating Temperature: 150°C; RoHS Compliant: Yes; Pins: 3
R126 = CMP-009-00205-1: as R117 on sheet VBATTPrimary; Max Operating Temperature: 125°C; Tolerance: 1%; Case/Package: 0201; Pins: 2; RoHS Compliant: Yes; Min Operating Temperature: -55°C
R127 = CMP-009-00089-2: as R118 on sheet VBATTPrimary; Pins: 2; Tolerance: 1%; Case/Package: 0402; Mounting Technology: SMT
R128 = CMP-009-00206-1: as R119 on sheet VBATTPrimary; Min Operating Temperature: -55°C; Mounting Technology: Surface Mount; Case/Package: 0603; Max Operating Temperature: 155°C; RoHS Compliant: Yes; Pins: 2; Tolerance: 1%
R129 = CMP-009-00022-5: as R120 on sheet VBATTPrimary; Mounting Technology: SM; Pins: 2; Min Operating Temperature: -55°C; Tolerance: 1%; RoHS Compliant: True; Case/Package: 0402; Max Operating Temperature: 155°C
R130 = CMP-26527-000133-1: as R121 on sheet VBATTPrimary; Lead Free: Lead Free; Military Standard: Not; Case Code (Imperial): 1206; Max Operating Temperature: 155°C; Case Code (Metric): 3216; Height: 0.026inch; Packaging: Tape and Reel; Case/Package: 1206; Series: CSR; Number of Terminations: 2; RoHS Compliant: Yes; Mount: Surface Mount; Depth: 1.55mm; Contact Plating: Tin; Length: 0.12inch; Radiation Hardening: No; Width: 0.061inch; Size Code: 1206; Power Rating: 500mW; Min Operating Temperature: -55°C; Tolerance: 1%; Resistor Type: Thick Film; Construction: Rectangular
R131 R132 = CMP-009-00152-3: as R122 on sheet VBATTPrimary; Pins: 2; Max Operating Temperature: 155°C; Min Operating Temperature: -55°C; Case/Package: 0402
R133 R134 = CMP-009-00192-1: as R124 on sheet VBATTPrimary; RoHS Compliant: Yes; Max Operating Temperature: 155°C; Case/Package: 1210; Min Operating Temperature: -55°C; Mounting Technology: Surface Mount; Tolerance: 5%; Pins: 2
U32 = CMP-09134-000012-1: as U30 on sheet VBATTPrimary; Number of Pins: 12; Features: Latched Fault; Max Operating Temperature: 125°C; Mount: Surface Mount; Packaging: Rail/Tube; Min Operating Temperature: -40°C; REACH SVHC: No SVHC; Case/Package: MSOP; RoHS Compliant: Yes
U33 = CMP-010-00025-1: as U31 on sheet VBATTPrimary; Case/Package: LSSOP; Max Operating Temperature: 125°C; Min Operating Temperature: -40°C; Pins: 8; RoHS Compliant: Yes

## Sheet WatchDog.SchDoc
size A; SheetNumber: 11; SheetTotal: 13
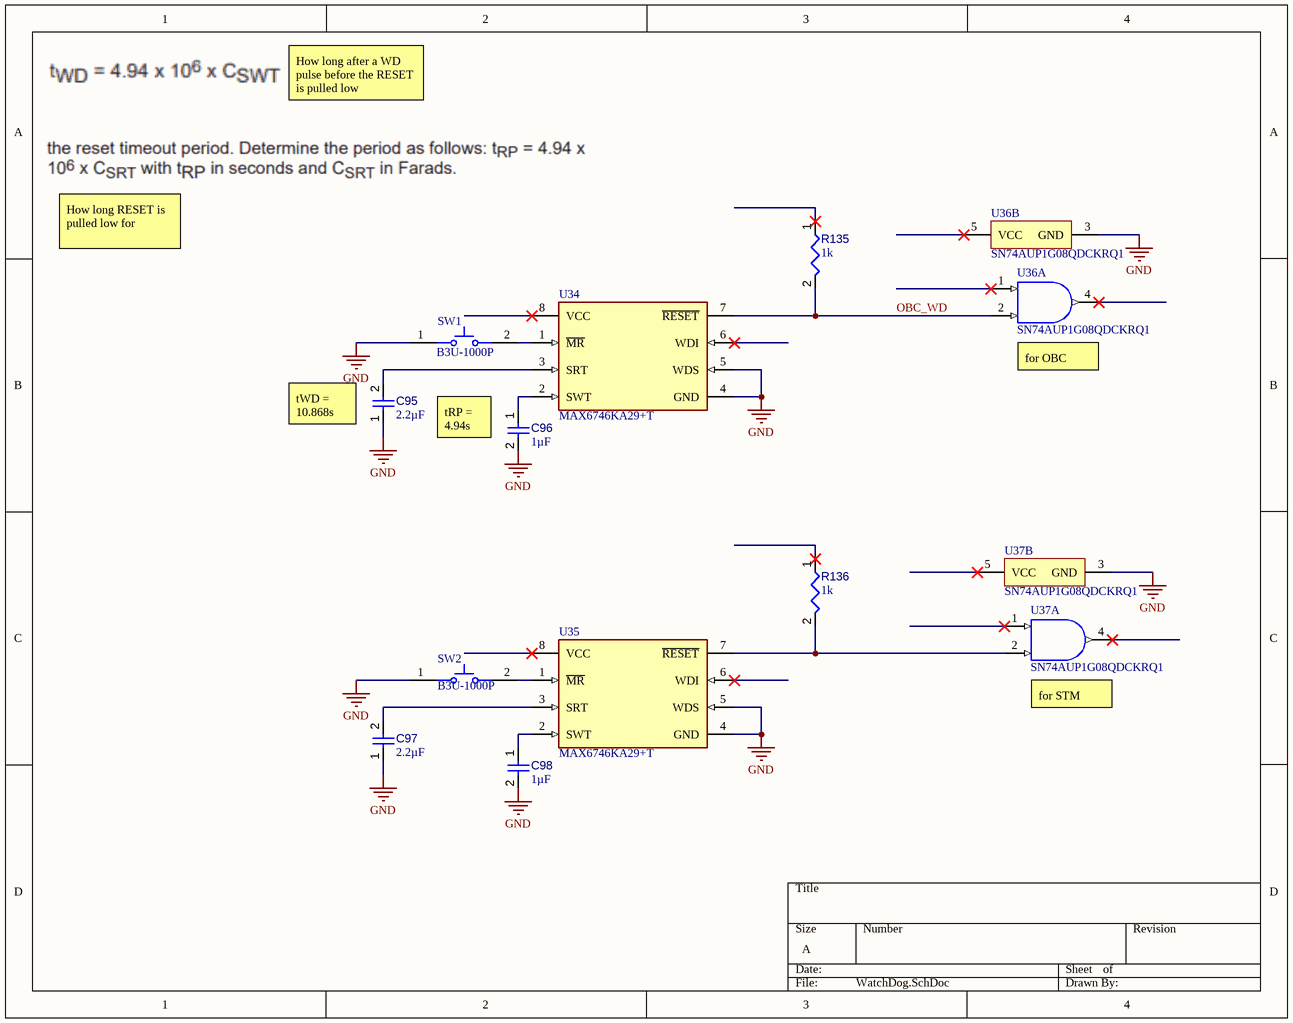
[diagram p11: WatchDog.SchDoc]

### Parts
C95  value 2.2µF  [CAPC0402(1005)60_L]  (hidden comment: Capacitor 2,2µF +/-20% 10V 0402)
C96  value 1µF  [CAPC0603(1608)100_L]  (hidden comment: Capacitor 1µF +/-40% 50V 0603)
C97  value 2.2µF  [CAPC0402(1005)60_L]  (hidden comment: Capacitor 2,2µF +/-20% 10V 0402)
C98  value 1µF  [CAPC0603(1608)100_L]  (hidden comment: Capacitor 1µF +/-40% 50V 0603)
R135  value 1k  [RESC0805(2012)_L]  (hidden comment: 1KR5J)
R136  value 1k  [RESC0805(2012)_L]  (hidden comment: 1KR5J)
SW1  B3U-1000P  [OMRON-B3U-1000_V]
SW2  B3U-1000P  [OMRON-B3U-1000_V]
U34  MAX6746KA29+T  [FP-K8-5-IPC_C]
U35  MAX6746KA29+T  [FP-K8-5-IPC_C]
U36  SN74AUP1G08QDCKRQ1  [DCK0005A_N]  (parts A,B of 2)
U37  SN74AUP1G08QDCKRQ1  [DCK0005A_N]  (parts A,B of 2)

### Nets
GND: C95.1 C96.2 C97.1 C98.2 SW1.1 SW2.1 U34.4(GND) U34.5(WDS) U35.4(GND) U35.5(WDS) U36.3(GND) U37.3(GND)
OBC_WD: R135.2 U34.7(~{RESET}) U36.2(B)
NetC95_2: C95.2 U34.3(SRT)
NetC96_1: C96.1 U34.2(SWT)
NetC97_2: C97.2 U35.3(SRT)
NetC98_1: C98.1 U35.2(SWT)
NetR136_2: R136.2 U35.7(~{RESET}) U37.2(B)
NetSW1_2: SW1.2 U34.1(~{MR})
NetSW2_2: SW2.2 U35.1(~{MR})

Not connected (* = marked no-connect by the designer): R135 1*; R136 1*; U34 6(WDI)* 8(VCC)*; U35 6(WDI)* 8(VCC)*; U36 1(A)* 4(Y)* 5(VCC)*; U37 1(A)* 4(Y)* 5(VCC)*

### Notes on the sheet
- How long after a WD pulse before the RESET is pulled low
- How long RESET is pulled low for
- (near U36) for OBC
- (near C95) tWD = 10.868s
- (near C96) tRP = 4.94s
- (near U37) for STM

### Library data of the parts
C95 C97 = CMP-001-00056-4: Chip Capacitor, 2,2µF +/-20%, 10V, 0402, Thickness 0.6 mm; Tolerance: 10%; Mounting Technology: SMT; Max Operating Temperature: 85°C; Case/Package: 0402; Pins: 2; Min Operating Temperature: -55°C; Voltage Rating: 10V
C96 C98 = CMP-001-00078-4: Chip Capacitor, 1µF +/-40%, 50V, 0603, Thickness 1 mm; Tolerance: 10%; Case/Package: 0603; Pins: 2; Max Operating Temperature: 85°C; Voltage Rating: 50V; Mounting Technology: SMT; Min Operating Temperature: -55°C
R135 R136 = CMP-009-00076-2: 1K 0.125W 5% 0805 (2012 Metric)  SMD; Power: 125mW; Pins: 2; Mounting Technology: SMT; Tolerance: 5%; Case/Package: 0805
SW1 SW2 = CMP-011-00000-2: Tactile Switch, SPST-NO, 0.05 A, 12 V, -25 to 70 degC, 2-Pin SMD, RoHS, Tape and Reel; Manufacturer: Omron Electronic Components; IP Rating: IP40; Current Rating: 50mA; Max Contact Resistance: 100mohm; Operating Force: 153gf; Throw Configuration: SPST; Resistance: 0.1Ohm; Max Voltage Rating (DC): 12V; Contact Material: Silver; Max Current Rating: 50mA; Datasheet URL: http://www.omron.com/ecb/products/pdf/en-b3u.pdf; Mounting Technology: SM; Case/Package: B3U-1000; Packaging: TapeandReel; Package Reference: B3U-1000; Manufacturer URL: http://www.omron.com/; Datasheet Version: Jan-15; RoHS Compliant: True; Max Operating Temperature: 70°C; Contact Current Rating: 50mA; Package Quantity: 3500; Package Description: 2-Pin Surface Mount Device, Body 3 x 2.5 mm; Voltage Rating (DC): 12V; Min Operating Temperature: -25°C; Voltage Rating: 12V
U34 U35 = CMP-00023-00003-1: Power Supply Management Circuit, Adjustable, 1 Channel, BICMOS, PDSO8; Pins: 8; RoHS Compliant: Yes; Max Operating Temperature: 125°C; Case/Package: LSSOP; Min Operating Temperature: -40°C
U36 U37 = CMP-016-00011-1: AND Gate, AUP/ULP/V Series, 1-Func, 2-Input, CMOS, PDSO5; Max Supply Voltage: 3.6V; Min Supply Voltage: 800mV; Nominal Supply Voltage: 3.3V; Case/Package: TSSOP; Max Operating Temperature: 125°C; RoHS Compliant: Yes; Pins: 5; Logic Type: AND GATE; Min Operating Temperature: -40°C

## Nets that join several sheets
GND: 3V3_Buck (12 pins), 3V3Primary (6 pins), 3V3Secondary (6 pins), 5V_Buck (12 pins), 5VPrimary (8 pins), 5VSecondary (6 pins), MemoryLatch (U40.2 U40.6), PC104 (21 pins), STM32 (23 pins), VBATTPrimary (6 pins), VBATTSecondary (5 pins), WatchDog (12 pins)